# EAGLE schematic NAME_of_the_Game_(NAND_Circuitry_+_Op-Amp_Comparator)_v1 (EAGLE 9.7.0)

## Sheet 1 of 3
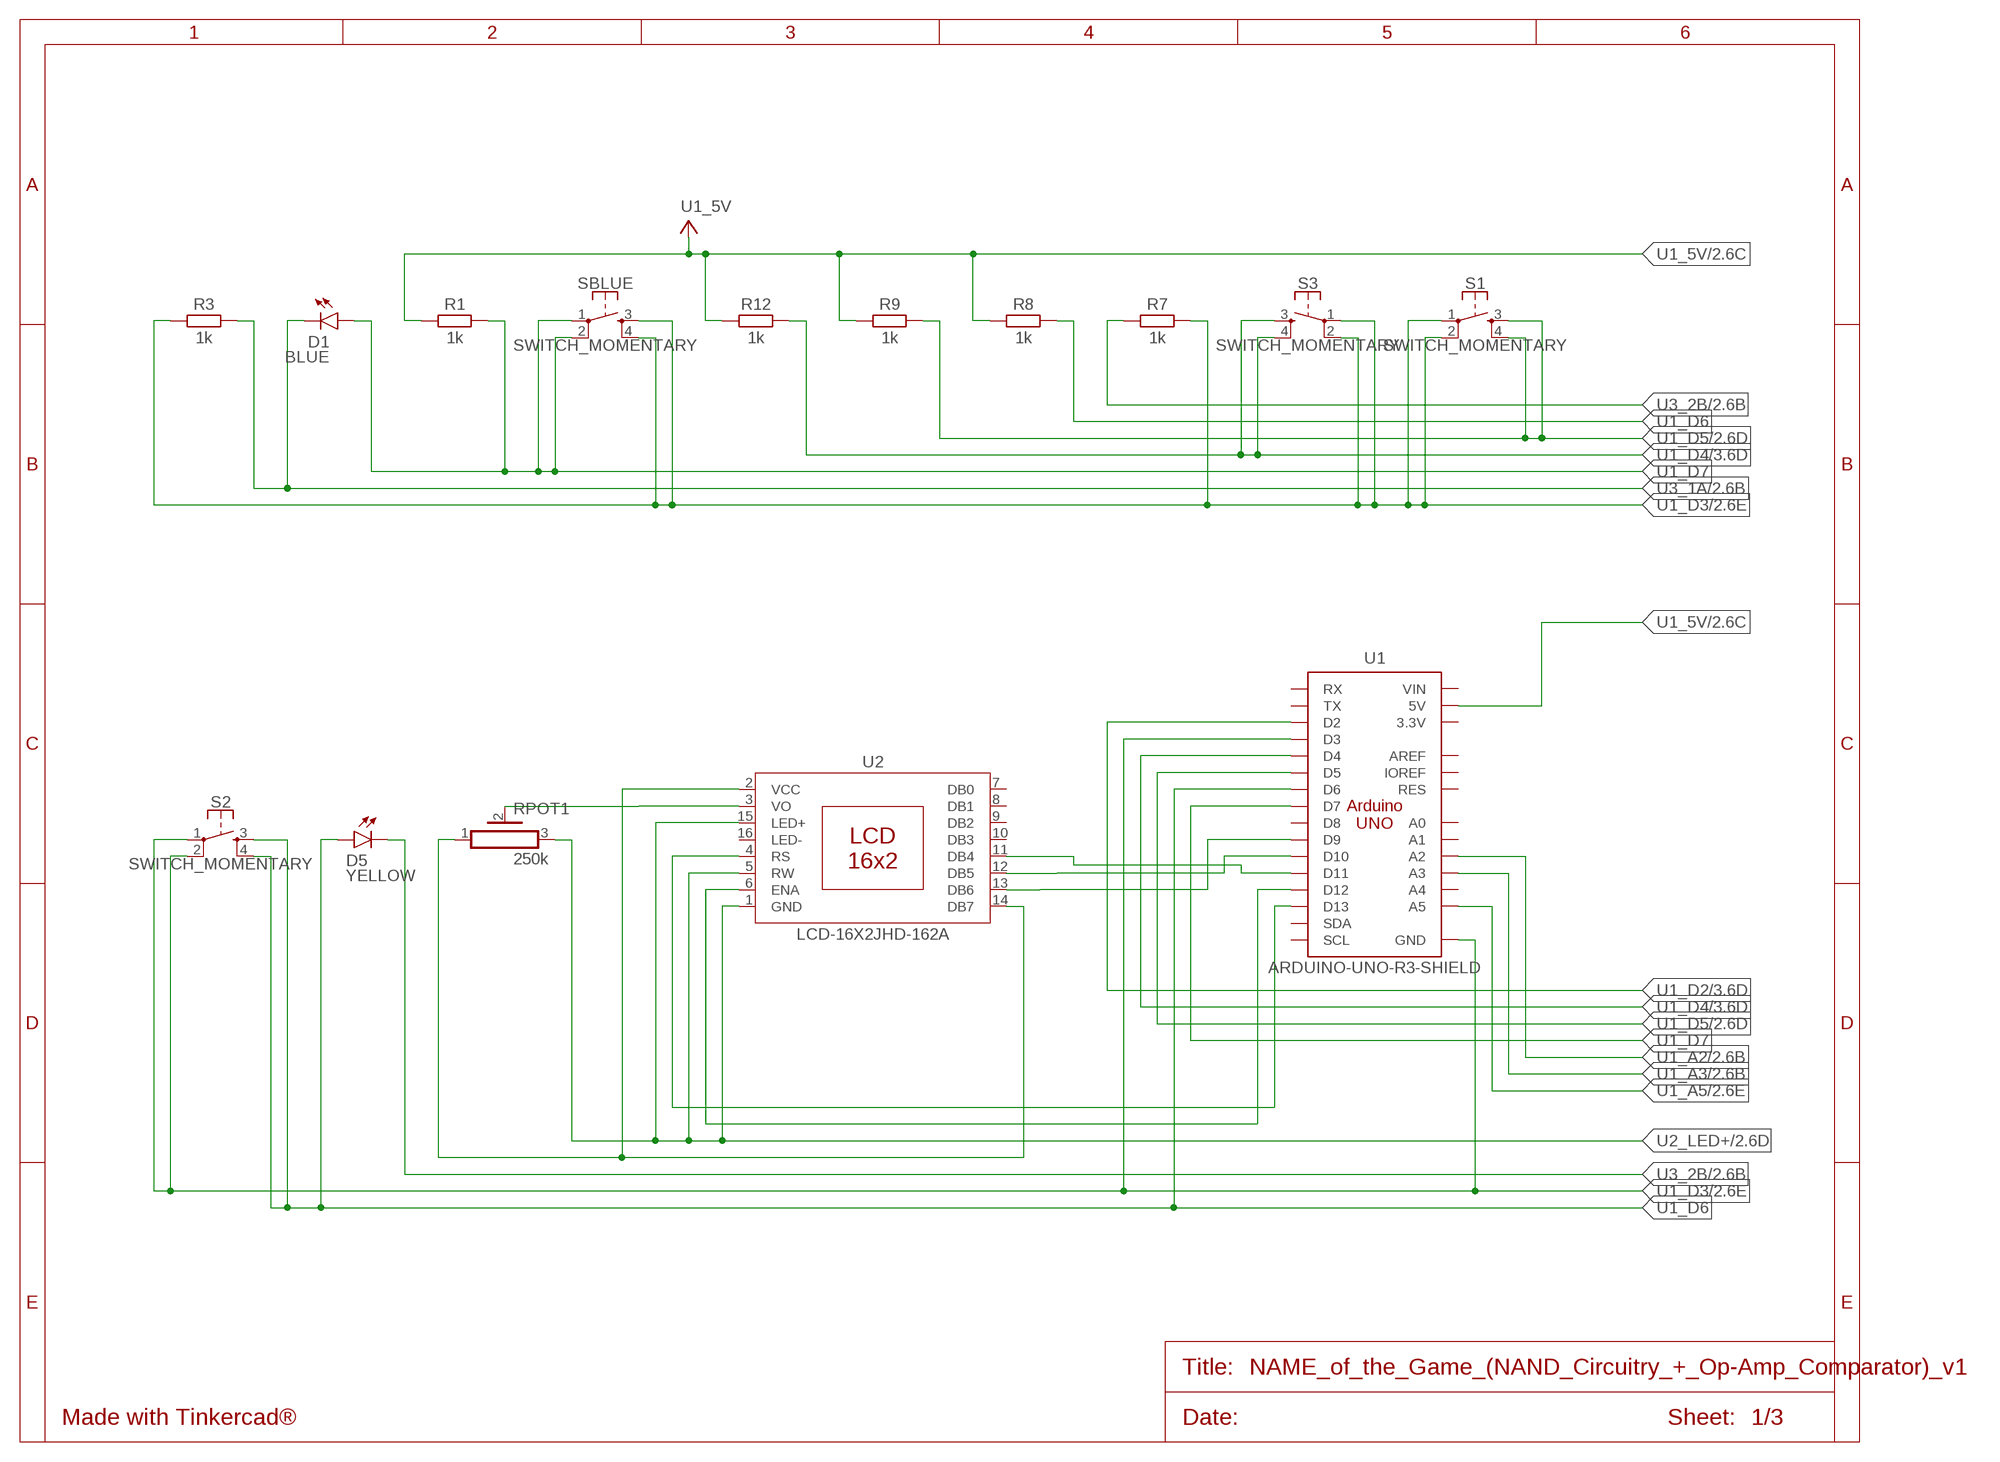
[diagram p0: schematic, sheet 1]

### Parts
D1  BLUE  LED_RADIAL_BLUE  [LEDRD254W60D565H860B_B]
D5  YELLOW  LED_RADIAL_YELLOW  [LEDRD254W60D565H860B_Y]
R1  1k  RESISTOR_AXIAL-10.16MM-PITCH  [RESAD1016W63L850D250B]
R3  1k  RESISTOR_AXIAL-10.16MM-PITCH  [RESAD1016W63L850D250B]
R7  1k  RESISTOR_AXIAL-10.16MM-PITCH  [RESAD1016W63L850D250B]
R8  1k  RESISTOR_AXIAL-10.16MM-PITCH  [RESAD1016W63L850D250B]
R9  1k  RESISTOR_AXIAL-10.16MM-PITCH  [RESAD1016W63L850D250B]
R12  1k  RESISTOR_AXIAL-10.16MM-PITCH  [RESAD1016W63L850D250B]
RPOT1  250k  POT_HA-06  [HA-06-SM065]
S1  SWITCH_MOMENTARY  [SWITCH-MOMENTARY-PTH-6.5MM]
S2  SWITCH_MOMENTARY  [SWITCH-MOMENTARY-PTH-6.5MM]
S3  SWITCH_MOMENTARY  [SWITCH-MOMENTARY-PTH-6.5MM]
SBLUE  SWITCH_MOMENTARY  [SWITCH-MOMENTARY-PTH-6.5MM]
U1  ARDUINO-UNO-R3-SHIELD  [ARDUINO-UNO-R3-SHIELD]
U2  LCD-16X2JHD-162A  [JHD-162A]

### Nets
U1_5V: R1.1 R8.1 R9.1 R12.1 U1.5V ; also sheet 2,3
U1_A2: U1.A2 ; also sheet 2
U1_A3: U1.A3 ; also sheet 2
U1_A5: U1.A5 ; also sheet 2
U1_D2: U1.D2 ; also sheet 3
U1_D3: R3.2 R7.2 S1.1 S1.2 S2.1 S2.2 S3.1 S3.2 SBLUE.3 SBLUE.4 U1.D3 U1.GND@0(GND) U1.GND@1(GND) U1.GND@2(GND) ; also sheet 2,3
U1_D4: R12.2 S3.3 S3.4 U1.D4 ; also sheet 3
U1_D5: R9.2 S1.3 S1.4 U1.D5 ; also sheet 2
U1_D6: D5.1(A) R8.2 S2.3 S2.4 U1.D6
U1_D7: D1.1(A) R1.2 SBLUE.1 SBLUE.2 U1.D7
U1_D9: U1.D9 U2.13(DB6)
U1_D10: U1.D10 U2.12(DB5)
U1_D11: U1.D11 U2.11(DB4)
U1_D12: U1.D12 U2.6(ENA)
U1_D13: U1.D13 U2.4(RS)
U2_DB7: RPOT1.1 U2.2(VCC) U2.14(DB7)
U2_LED+: RPOT1.3 U2.1(GND) U2.5(RW) U2.15(LED+) ; also sheet 2
U2_VO: RPOT1.2 U2.3(VO)
U3_1A: D1.2(C) R3.1 ; also sheet 2
U3_2B: D5.2(C) R7.1 ; also sheet 2
Unconnected: U1.3.3V U1.A0 U1.A1 U1.A4 U1.AREF U1.D8 U1.IOREF U1.RES U1.RX U1.SCL U1.SDA U1.TX U1.VIN U2.7(DB0) U2.8(DB1) U2.9(DB2) U2.10(DB3) U2.16(LED-)

## Sheet 2 of 3
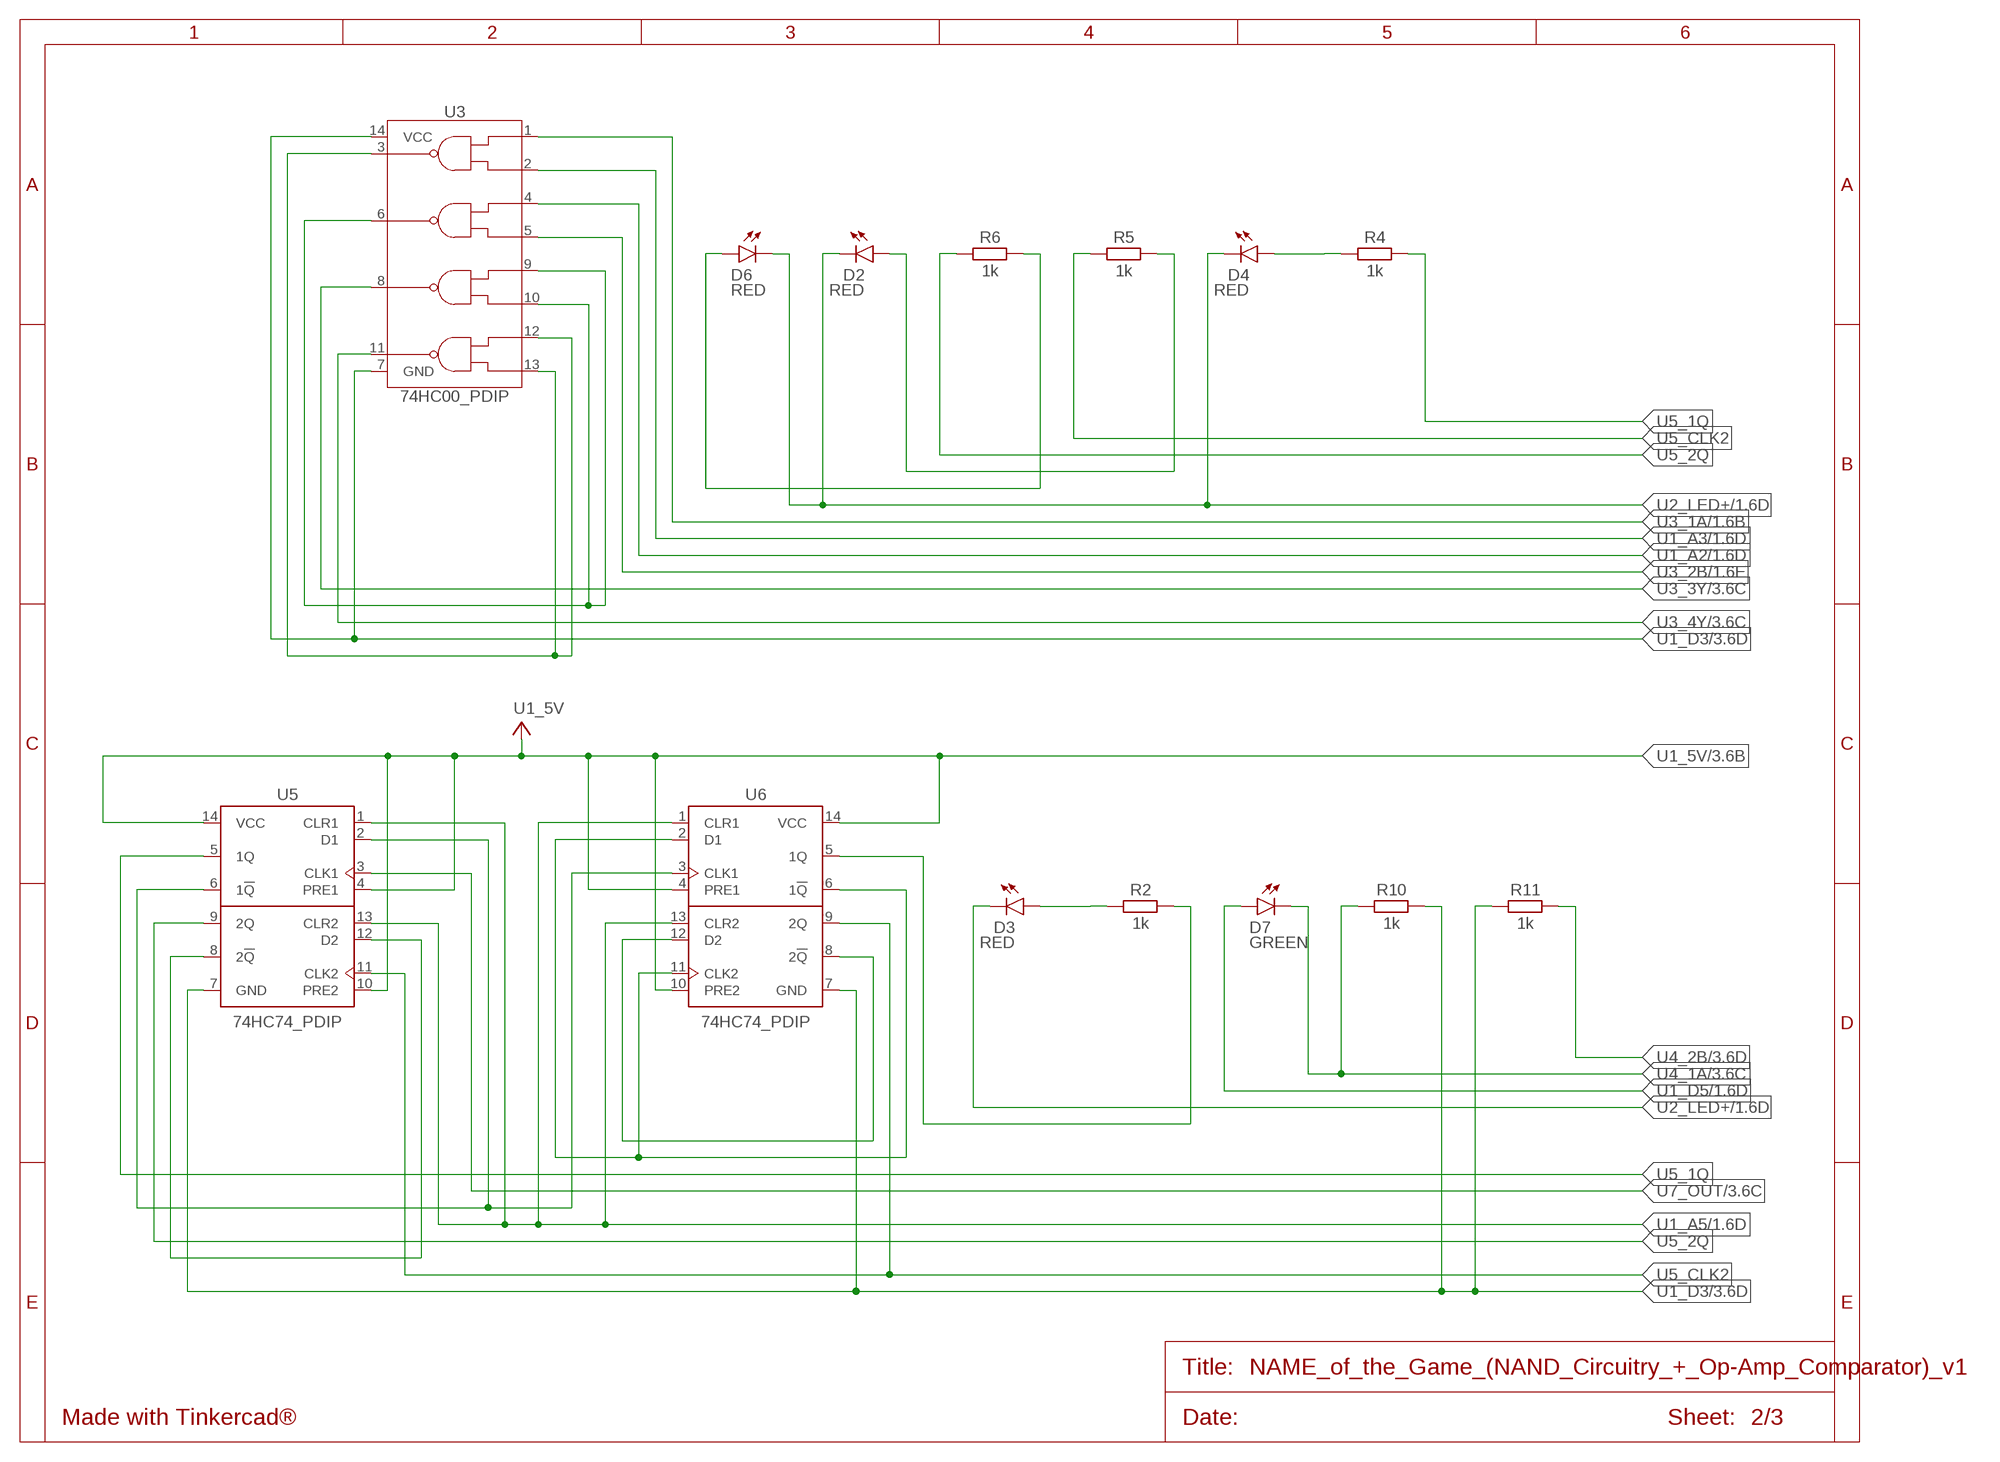
[diagram p1: schematic, sheet 2]

### Parts
D2  RED  LED_RADIAL_RED  [LEDRD254W60D565H860B]
D3  RED  LED_RADIAL_RED  [LEDRD254W60D565H860B]
D4  RED  LED_RADIAL_RED  [LEDRD254W60D565H860B]
D6  RED  LED_RADIAL_RED  [LEDRD254W60D565H860B]
D7  GREEN  LED_RADIAL_GREEN  [LEDRD254W60D565H860B_G]
R2  1k  RESISTOR_AXIAL-10.16MM-PITCH  [RESAD1016W63L850D250B]
R4  1k  RESISTOR_AXIAL-10.16MM-PITCH  [RESAD1016W63L850D250B]
R5  1k  RESISTOR_AXIAL-10.16MM-PITCH  [RESAD1016W63L850D250B]
R6  1k  RESISTOR_AXIAL-10.16MM-PITCH  [RESAD1016W63L850D250B]
R10  1k  RESISTOR_AXIAL-10.16MM-PITCH  [RESAD1016W63L850D250B]
R11  1k  RESISTOR_AXIAL-10.16MM-PITCH  [RESAD1016W63L850D250B]
U3  74HC00_PDIP  [DIP762W53P254L1969H508Q14B]
U5  74HC74_PDIP  [DIP762W53P254L1969H508Q14B]
U6  74HC74_PDIP  [DIP762W53P254L1969H508Q14B]

### Nets
D2_A: D2.1(A) R5.2
D3_A: D3.1(A) R2.2
D4_A: D4.1(A) R4.2
D6_A: D6.1(A) R6.2
U1_5V: U5.4(PRE1) U5.10(PRE2) U5.14(VCC) U6.4(PRE1) U6.10(PRE2) U6.14(VCC) ; also sheet 1,3
U1_A2: U3.4(2A) ; also sheet 1
U1_A3: U3.2(1B) ; also sheet 1
U1_A5: U5.1(CLR1) U5.13(CLR2) U6.1(CLR1) U6.13(CLR2) ; also sheet 1
U1_D3: R10.2 R11.2 U3.7(GND) U3.14(VCC) U5.7(GND) U6.7(GND) ; also sheet 1,3
U1_D5: D7.1(A) ; also sheet 1
U2_LED+: D2.2(C) D3.2(C) D4.2(C) D6.2(C) ; also sheet 1
U3_1A: U3.1(1A) ; also sheet 1
U3_1Y: U3.3(1Y) U3.12(4A) U3.13(4B)
U3_2B: U3.5(2B) ; also sheet 1
U3_2Y: U3.6(2Y) U3.9(3A) U3.10(3B)
U3_3Y: U3.8(3Y) ; also sheet 3
U3_4Y: U3.11(4Y) ; also sheet 3
U4_1A: D7.2(C) R10.1 ; also sheet 3
U4_2B: R11.1 ; also sheet 3
U5_1!Q: U5.2(D1) U5.6(1!Q) U6.3(CLK1)
U5_1Q: R4.1 U5.5(1Q)
U5_2!Q: U5.8(2!Q) U5.12(D2)
U5_2Q: R6.1 U5.9(2Q)
U5_CLK2: R5.1 U5.11(CLK2) U6.9(2Q)
U6_1!Q: U6.2(D1) U6.6(1!Q) U6.11(CLK2)
U6_1Q: R2.1 U6.5(1Q)
U6_2!Q: U6.8(2!Q) U6.12(D2)
U7_OUT: U5.3(CLK1) ; also sheet 3

## Sheet 3 of 3
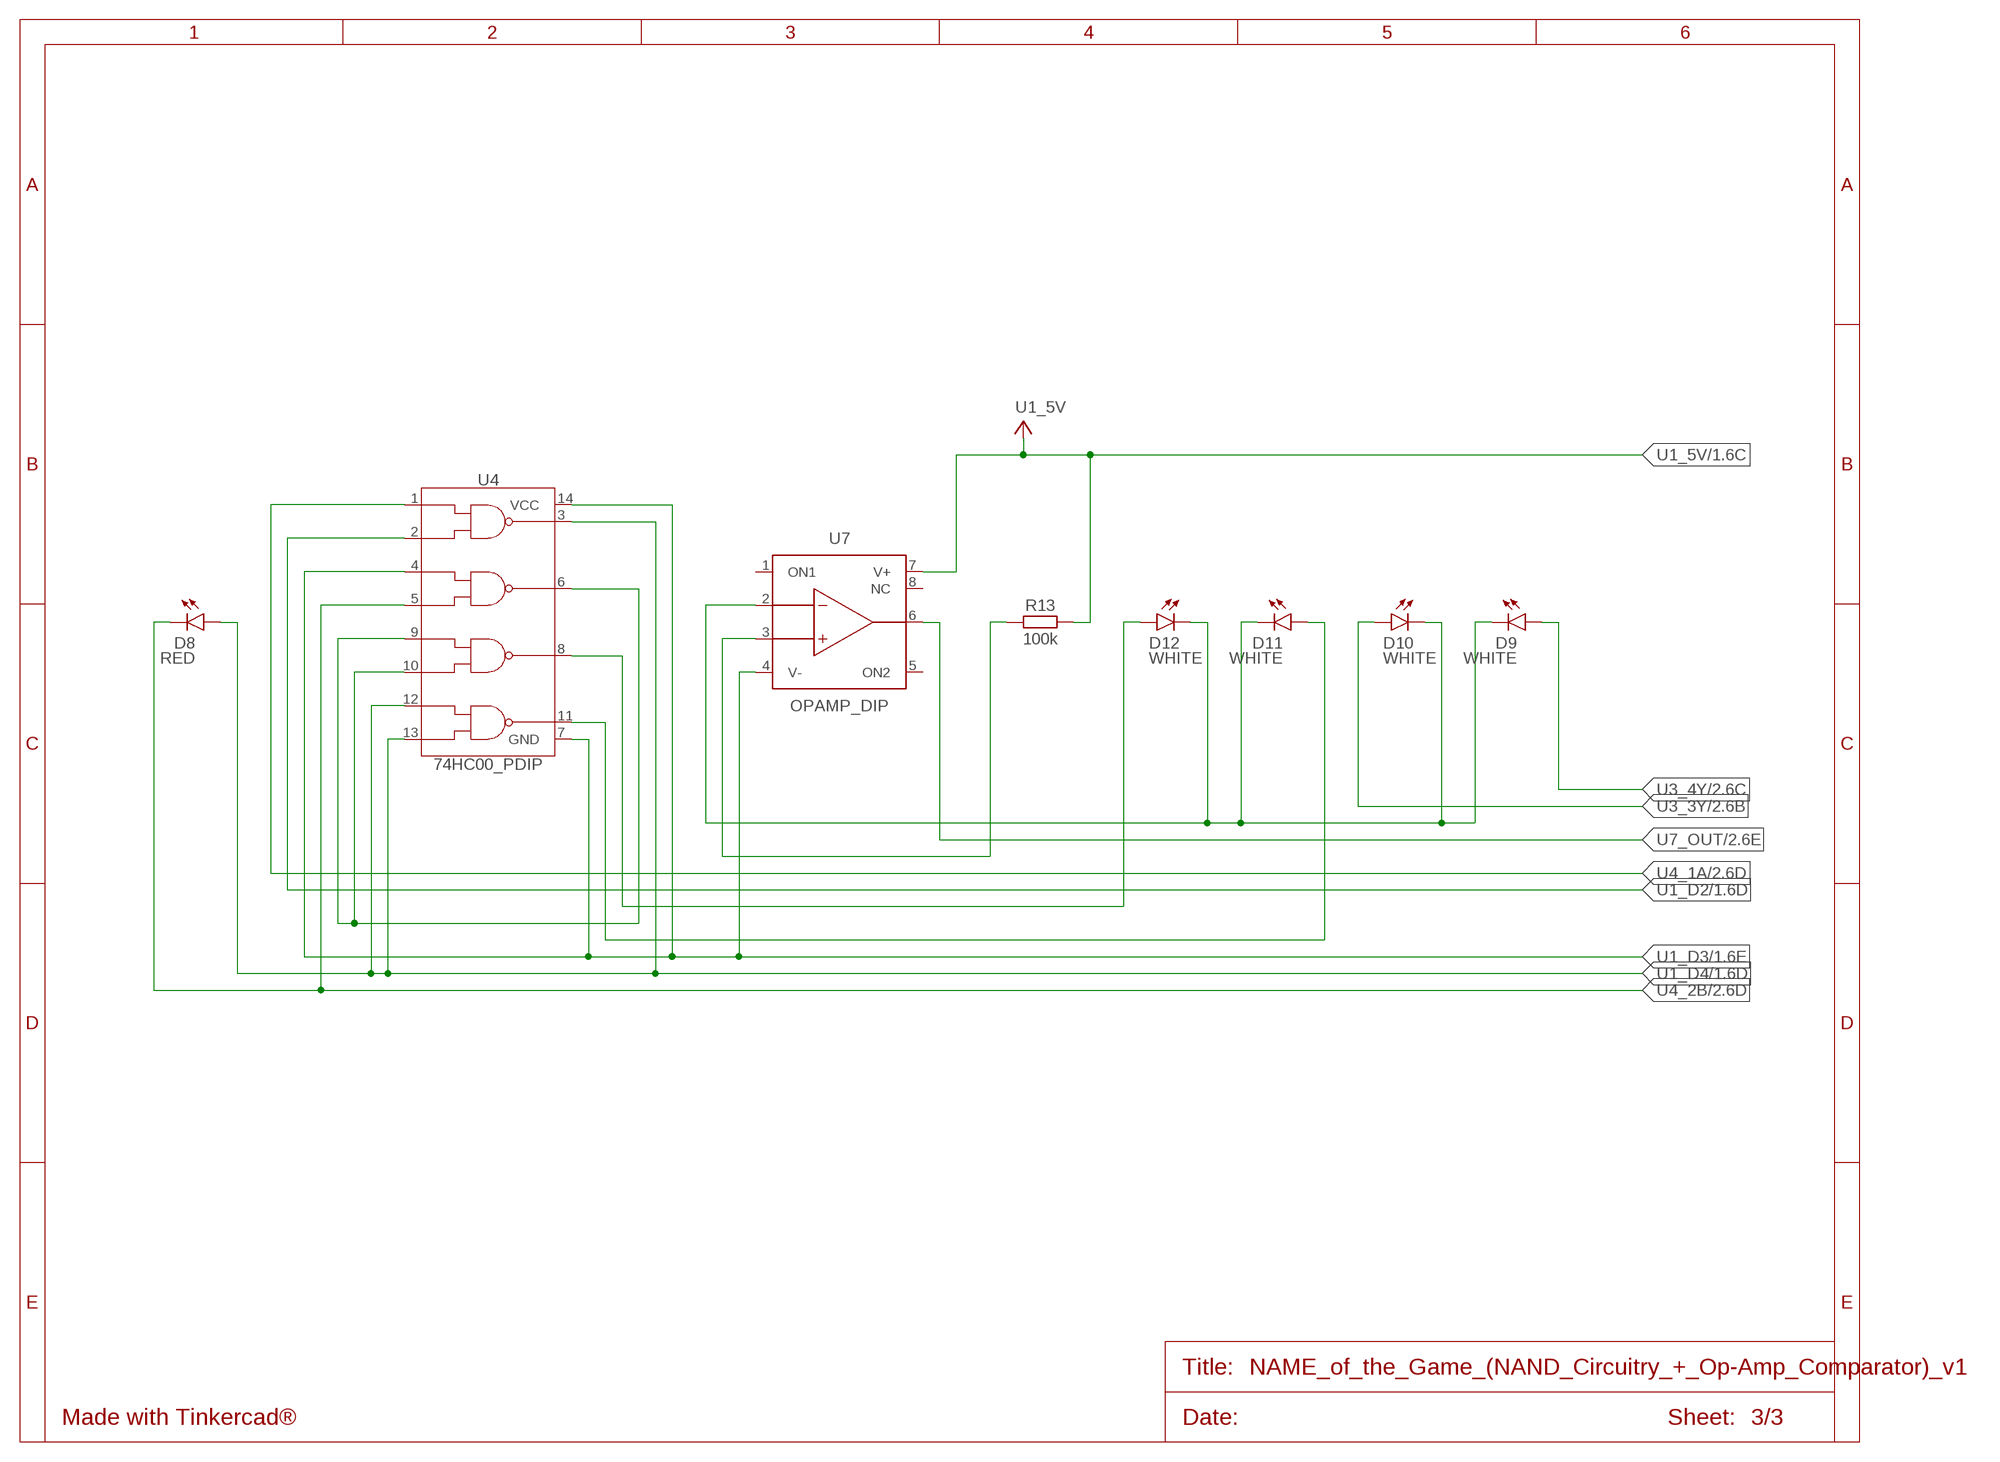
[diagram p2: schematic, sheet 3]

### Parts
D8  RED  LED_RADIAL_RED  [LEDRD254W60D565H860B]
D9  WHITE  LED_RADIAL_WHITE  [LEDRD254W60D565H860B_W]
D10  WHITE  LED_RADIAL_WHITE  [LEDRD254W60D565H860B_W]
D11  WHITE  LED_RADIAL_WHITE  [LEDRD254W60D565H860B_W]
D12  WHITE  LED_RADIAL_WHITE  [LEDRD254W60D565H860B_W]
R13  100k  RESISTOR_AXIAL-10.16MM-PITCH  [RESAD1016W63L850D250B]
U4  74HC00_PDIP  [DIP762W53P254L1969H508Q14B]
U7  OPAMP_DIP  [DIP826W53P254L959H508Q8B]

### Nets
U1_5V: R13.1 U7.7(V+) ; also sheet 1,2
U1_D2: U4.2(1B) ; also sheet 1
U1_D3: U4.4(2A) U4.7(GND) U4.14(VCC) U7.4(V-) ; also sheet 1,2
U1_D4: D8.1(A) U4.3(1Y) U4.12(4A) U4.13(4B) ; also sheet 1
U3_3Y: D10.1(A) ; also sheet 2
U3_4Y: D9.1(A) ; also sheet 2
U4_1A: U4.1(1A) ; also sheet 2
U4_2B: D8.2(C) U4.5(2B) ; also sheet 2
U4_2Y: U4.6(2Y) U4.9(3A) U4.10(3B)
U4_3Y: D12.1(A) U4.8(3Y)
U4_4Y: D11.1(A) U4.11(4Y)
U7_+IN: R13.2 U7.3(+IN)
U7_-IN: D9.2(C) D10.2(C) D11.2(C) D12.2(C) U7.2(-IN)
U7_OUT: U7.6(OUT) ; also sheet 2
Unconnected: U7.1(ON1) U7.5(ON2) U7.8(NC)

## Library data of the parts
D1 = Tinkercad:LED_RADIAL: LED - Generic; CATEGORY: Opto-Electronic; SUB-CATEGORY: LED; VALUE: LED_BLUE
D2-D4 D6 D8 = Tinkercad:LED_RADIAL: LED - Generic; CATEGORY: Opto-Electronic; SUB-CATEGORY: LED; VALUE: LED_RED
D5 = Tinkercad:LED_RADIAL: LED - Generic; CATEGORY: Opto-Electronic; SUB-CATEGORY: LED; VALUE: LED_YELLOW
D7 = Tinkercad:LED_RADIAL: LED - Generic; CATEGORY: Opto-Electronic; SUB-CATEGORY: LED; VALUE: LED_GREEN
D9-D12 = Tinkercad:LED_RADIAL: LED - Generic; CATEGORY: Opto-Electronic; SUB-CATEGORY: LED; VALUE: LED_WHITE
R1-R13 = Tinkercad:RESISTOR: Resistor Fixed - Generic
RPOT1 = Tinkercad:POT: Rectangular Trimmer Potentiometers - PV36 Series Datasheet <https://www.bourns.com/docs/Product-Datasheets/pv36.pdf>
S1-S3 SBLUE = Tinkercad:SWITCH_MOMENTARY
U1 = Tinkercad:ARDUINO-UNO-R3-SHIELD
U2 = Tinkercad:LCD-16X2
U3 U4 = Tinkercad:74HC00: Quadruple 2-Input NAND Gate Reference Datasheet <https://www.ti.com/lit/ds/symlink/sn74hc00.pdf?ts=1637559744705>
U5 U6 = Tinkercad:74HC74: Dual D flip-flop with Clear and Preset Reference Datasheet <https://www.ti.com/lit/ds/symlink/sn74hc74.pdf?ts=1637643844925&ref_url=https%253A%252F%252Fwww.google.com%252F>
U7 = Tinkercad:OPAMP